# Altium schematic sheet 09 Parallel Camera.SchDoc
size A2; ApprovedBy: DNP; CheckedBy: DNP; Author: DNP; CompanyName: Google LLC; DrawnBy: DNP; Organization: Google LLC; Address1: 1600 Amphitheatre Parkway; Address2: Mountain View, CA 94043; Address3: DNP; Address4: DNP; DocumentNumber: 9; SheetNumber: 9; SheetTotal: 17; VersionControl_RevNumber: DNP; IsUserConfigurable: DNP; Time: DNP; ImagePath: DNP; Rule: DNP; ProjectName: Enterprise; Application_BuildNumber: DNP
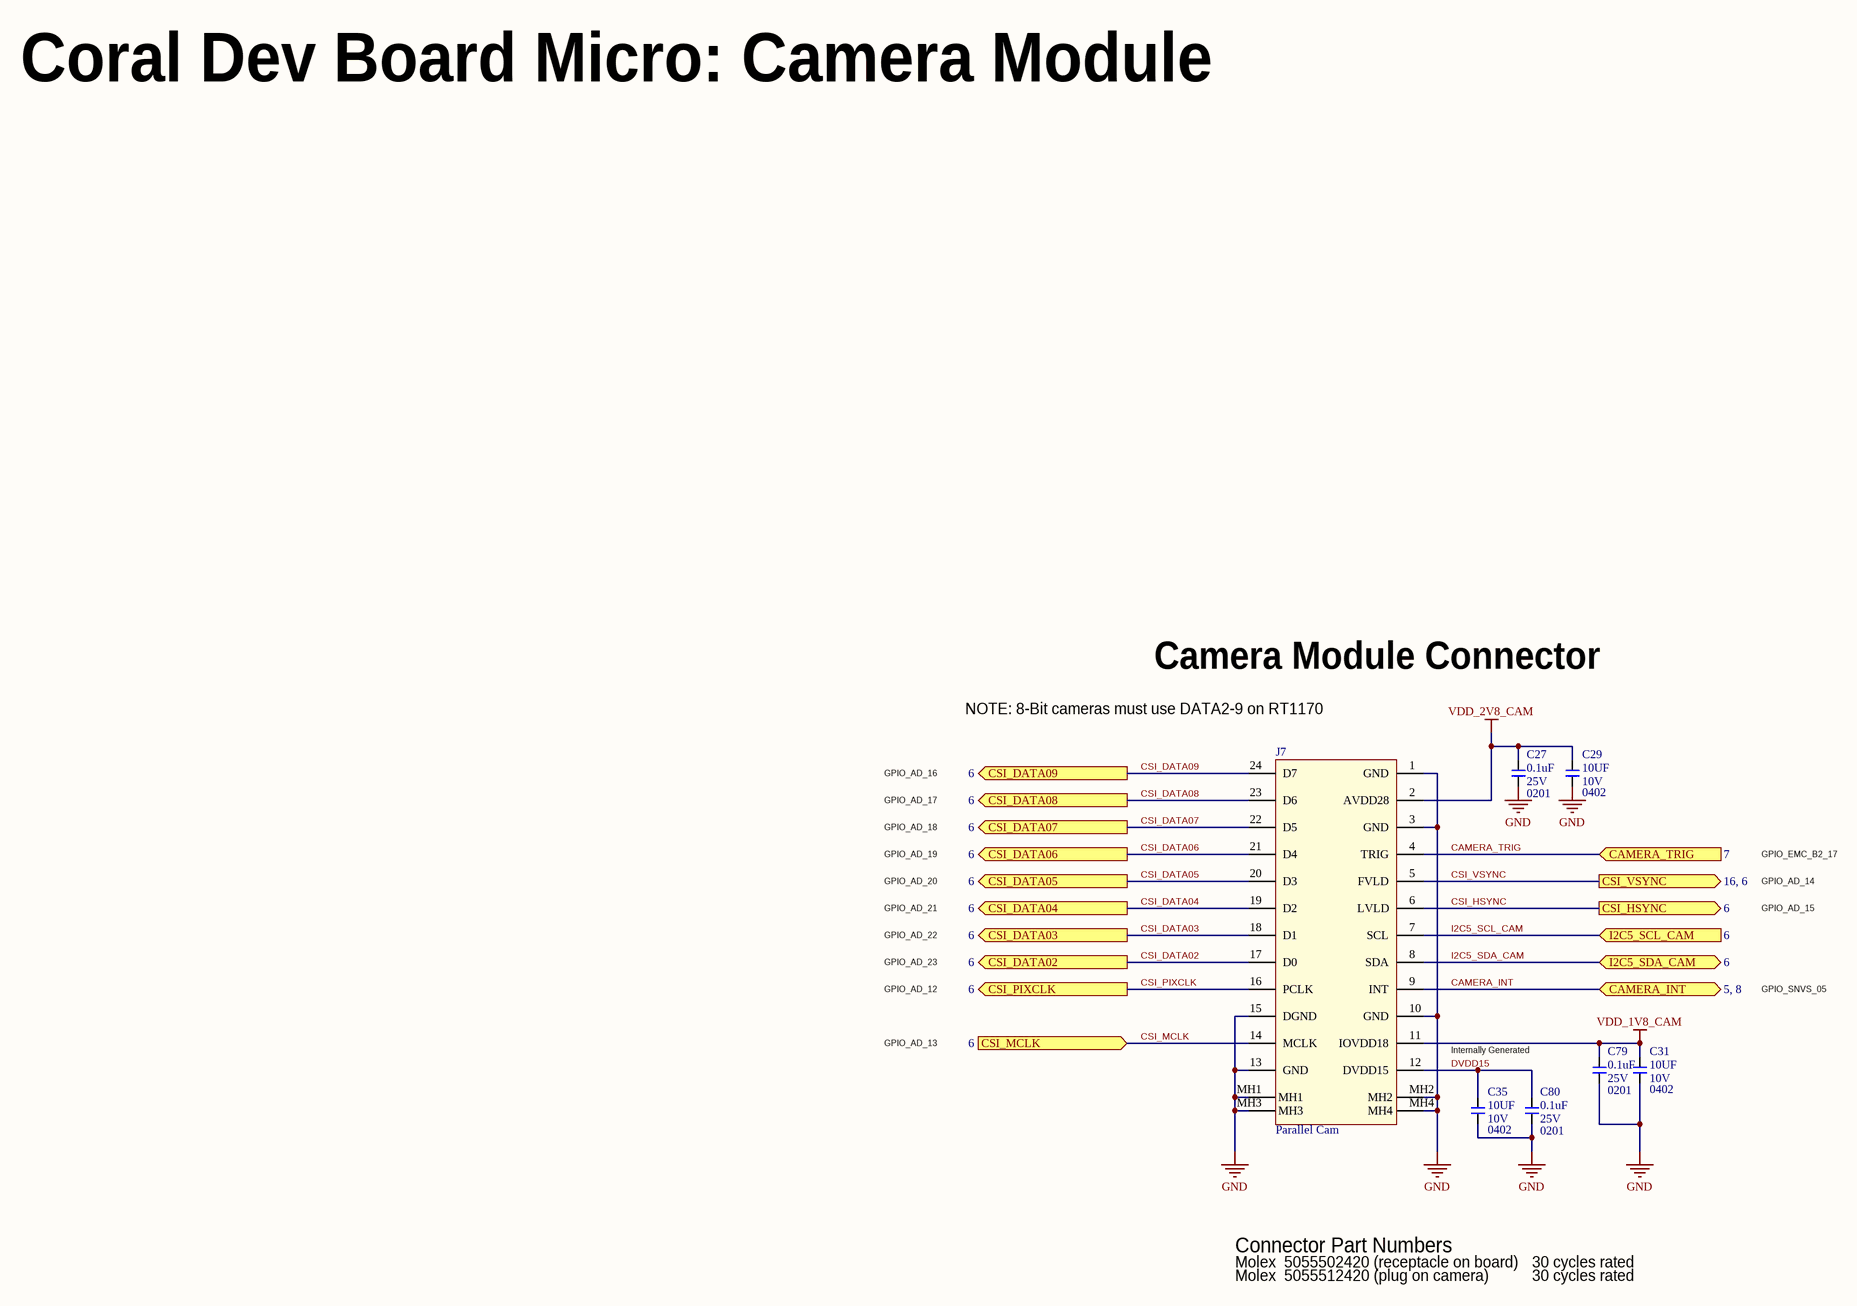
[diagram p0: 09 Parallel Camera.SchDoc]

## Parts
C27  value 0.1uF  Package: 0201  Voltage: 25V  [C0201Y]  (hidden comment: __Template_Cap)
C29  value 10UF  Package: 0402  Voltage: 10V  [C0402]  (hidden comment: __Template_Cap)
C31  value 10UF  Package: 0402  Voltage: 10V  [C0402]  (hidden comment: __Template_Cap)
C35  value 10UF  Package: 0402  Voltage: 10V  [C0402]  (hidden comment: __Template_Cap)
C79  value 0.1uF  Package: 0201  Voltage: 25V  [C0201Y]  (hidden comment: __Template_Cap)
C80  value 0.1uF  Package: 0201  Voltage: 25V  [C0201Y]  (hidden comment: __Template_Cap)
J7  MFG P/N: Parallel Cam  [Molex_5037722410_HM01B0]  (hidden comment: 1087)

## Ports
CAMERA_INT (bidir, see 5, 8), CAMERA_TRIG (in, see 7), CSI_DATA02 (out, see 6), CSI_DATA03 (out, see 6), CSI_DATA04 (out, see 6), CSI_DATA05 (out, see 6), CSI_DATA06 (out, see 6), CSI_DATA07 (out, see 6), CSI_DATA08 (out, see 6), CSI_DATA09 (out, see 6), CSI_HSYNC (out, see 6), CSI_MCLK (in, see 6), CSI_PIXCLK (out, see 6), CSI_VSYNC (out, see 16, 6), I2C5_SCL_CAM (in, see 6), I2C5_SDA_CAM (bidir, see 6)

## Nets
GND: C27.2 C29.2 C31.2 C35.2 C79.2 C80.2 J7.1(GND) J7.3(GND) J7.10(GND) J7.13(GND) J7.15(DGND) J7.MH1 J7.MH2 J7.MH3 J7.MH4
VDD_1V8_CAM: C31.1 C79.1 J7.11(IOVDD18)
VDD_2V8_CAM: C27.1 C29.1 J7.2(AVDD28)
CAMERA_INT: J7.9(INT) ; port CAMERA_INT
CAMERA_TRIG: J7.4(TRIG) ; port CAMERA_TRIG
CSI_DATA02: J7.17(D0) ; port CSI_DATA02
CSI_DATA03: J7.18(D1) ; port CSI_DATA03
CSI_DATA04: J7.19(D2) ; port CSI_DATA04
CSI_DATA05: J7.20(D3) ; port CSI_DATA05
CSI_DATA06: J7.21(D4) ; port CSI_DATA06
CSI_DATA07: J7.22(D5) ; port CSI_DATA07
CSI_DATA08: J7.23(D6) ; port CSI_DATA08
CSI_DATA09: J7.24(D7) ; port CSI_DATA09
CSI_HSYNC: J7.6(LVLD) ; port CSI_HSYNC
CSI_MCLK: J7.14(MCLK) ; port CSI_MCLK
CSI_PIXCLK: J7.16(PCLK) ; port CSI_PIXCLK
CSI_VSYNC: J7.5(FVLD) ; port CSI_VSYNC
DVDD15: C35.1 C80.1 J7.12(DVDD15)
I2C5_SCL_CAM: J7.7(SCL) ; port I2C5_SCL_CAM
I2C5_SDA_CAM: J7.8(SDA) ; port I2C5_SDA_CAM

## Notes on the sheet
- Coral Dev Board Micro: Camera Module
- NOTE: 8-Bit cameras must use DATA2-9 on RT1170
- Camera Module Connector
- GPIO_AD_16
- GPIO_AD_17
- GPIO_AD_18
- GPIO_AD_19
- GPIO_EMC_B2_17
- GPIO_AD_20
- GPIO_AD_21
- GPIO_AD_14
- GPIO_AD_15
- GPIO_AD_12
- GPIO_AD_22
- GPIO_AD_23
- GPIO_SNVS_05
- GPIO_AD_13
- Internally Generated
- Connector Part Numbers
- Molex  5055502420 (receptacle on board)
- Molex  5055512420 (plug on camera)
- 30 cycles rated
- Project:
- Engineer:
- Date:
- File:
- Revision:
- Sheet
- of

## Library data of the parts
C27 C79 C80 = 386: CAP, CER, X5R, 0.1uF, 25V, 20%, 0201, 0.33mm T; ID: 386; MFG: MURATA; MFG P/N: GRM033R61E104ME14D; XPN: 150-01204-00; Status: Released; Dielectric: X5R; Tolerance: 20%; Height: 0.33mm T; ComponentLink1Description: Datasheet; COMMON: 150-01204-00; LOON: 150-01204-00; Gecko: 150-01204-00
C29 C31 C35 = 215: CAP, CER, X5R, 10uF, 10V, 20%, 0402, 0.7mm T; ID: 215; MFG: SAMSUNG; MFG P/N: CL05A106MP5NUNC; XPN: 150-00376-00; PROXY: Use ID #1342; EES: 150-04565-00; Status: Released; Dielectric: X5R; Tolerance: 20%; Height: 0.7mm T; ComponentLink1Description: Datasheet; COMMON: 150-00376-00; LOON: 150-00376-00; Gecko: 150-00376-00
J7 = 1087: HM01B0, CONN, RCPT, OUTER SHROUD, 2x12 PIN, 0.4MM P, 0.65MM H, GOLD, SM; MFG: Molex; Connector Type: Receptacle; Number of Positions: 24; Row Spacing: 2.35mm; ID: 1087; Status: Released; RoHS Compliant: Yes; Mounting Type: Surface Mount; Orientation: Vertical; Pitch: 0.4mm; Number of Rows: 2; Gender: Receptacle; Features: Outer Shroud Contacts; Supplier 1: Digi-Key; HelpURL: https://www.digikey.com/product-detail/en/molex/5037722410/WM6251CT-ND/2794320; ComponentLink1Description: Datasheet; ComponentLink1URL: https://www.molex.com/pdm_docs/sd/5037722410_sd.pdf; Height: 0.76mm; Supplier Part Number 1: WM6251CT-ND; ComponentLink2Description: HMB01B0 Datasheet; ComponentLink2URL: https://drive.google.com/a/google.com/file/d/1hz92MYY5mTVHUf_ZbvAIbaEPUMPymuL2/view?usp=sharing